# Altium schematic sheet edge_dff_rst_active.SchDoc
size A4
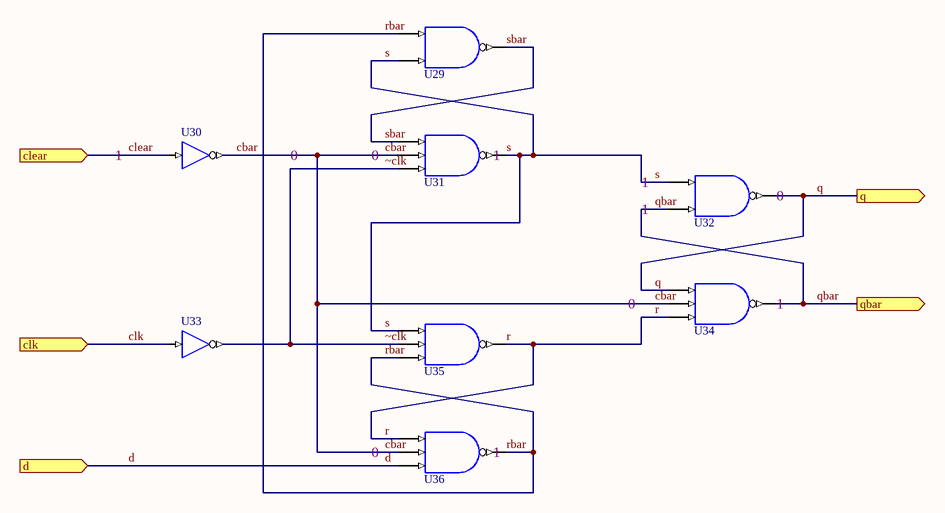
[diagram p0: edge_dff_rst_active.SchDoc]

## Parts
U29  AND 2  (value not drawn)
U30  BUF_inv  (value not drawn)
U31  NAND_3  (value not drawn)
U32  AND 2  (value not drawn)
U33  BUF_inv  (value not drawn)
U34  NAND_3  (value not drawn)
U35  NAND_3  (value not drawn)
U36  NAND_3  (value not drawn)

## Ports
clear (in), clk (in), d (in), q (out), qbar (out)

## Nets
cbar: U30.O U31.B U34.B U36.B
clear: U30.I ; port clear
clk: U33.I ; port clk
d: U36.C ; port d
q: U32.Y U34.A ; port q
qbar: U32.B U34.Y ; port qbar
r: U34.C U35.Y U36.A
rbar: U29.A U35.C U36.Y
s: U29.B U31.Y U32.A U35.A
sbar: U29.Y U31.A
~clk: U31.C U33.O U35.B

## Notes on the sheet
- 1
- 0
- (near U31) 0
- (near U31) 1
- (near U32) 1
- (near U32) 0
- (near U34) 1
- (near U36) 0
- (near U36) 1

## Library data of the parts
U29 U32 = AND_2: 2 Input AND
U30 U33 = BUF_inv: 1-bit General Purpose (Non-inverting) Buffer
U31 U34-U36 = NAND_3: 3 Input NAND 1 Not